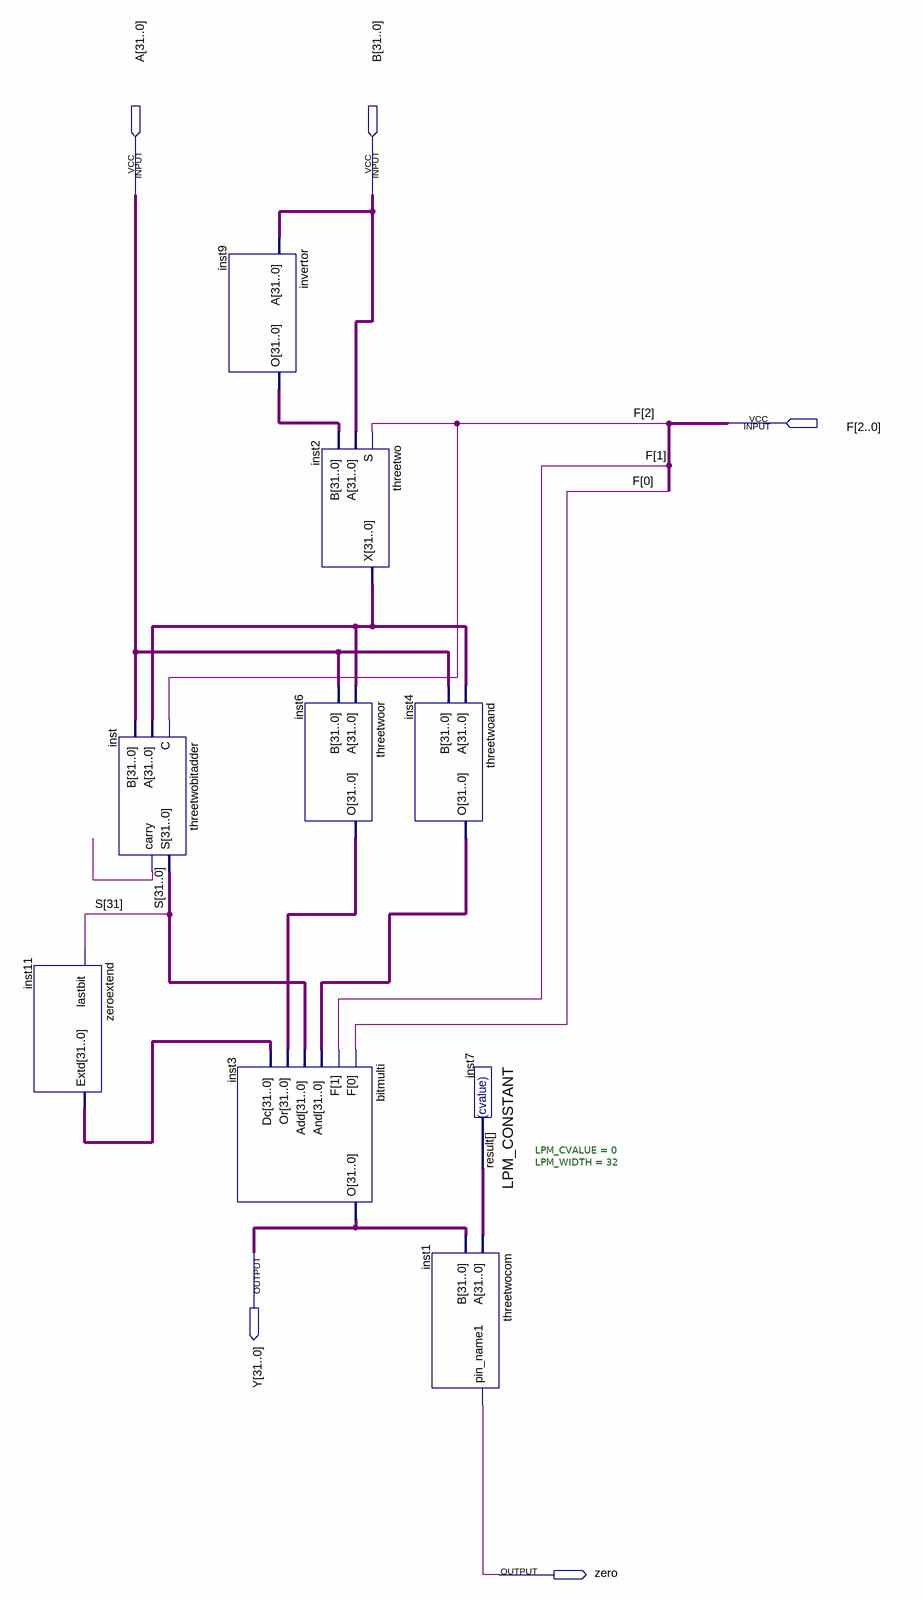
[diagram p0: schematic sheet]
// Quartus schematic alu.bdf as structural Verilog: 9 symbols, 5 pins
module alu (
  input  [31:0] A,
  input  [31:0] B,
  input  [2:0] F,
  output [31:0] Y,
  output zero
);

  wire inst_carry;
  wire [31:0] inst2_x, inst4_o, inst6_o, inst7_result, inst9_o, inst11_extd, S;

  zeroextend inst11 (.lastbit(S[31]), .Extd(inst11_extd));
  threetwobitadder inst (.C(F[2]), .A(inst2_x), .B(A), .S(S), .carry(inst_carry));
  invertor inst9 (.A(B), .O(inst9_o));
  bitmulti inst3 (.F(F[1:0]), .And(inst4_o), .Add(S), .Or(inst6_o), .Dc(inst11_extd), .O(Y));
  threetwo inst2 (.S(F[2]), .A(B), .B(inst9_o), .X(inst2_x));
  threetwoor inst6 (.A(inst2_x), .B(A), .O(inst6_o));
  threetwoand inst4 (.A(inst2_x), .B(A), .O(inst4_o));
  LPM_CONSTANT #(.LPM_CVALUE(0), .LPM_WIDTH(32)) inst7 (.result(inst7_result));
  threetwocom inst1 (.A(inst7_result), .B(Y), .pin_name1(zero));
endmodule
